# EAGLE schematic openSX70-dongle_SEEED_v400 (EAGLE 9.0.0)
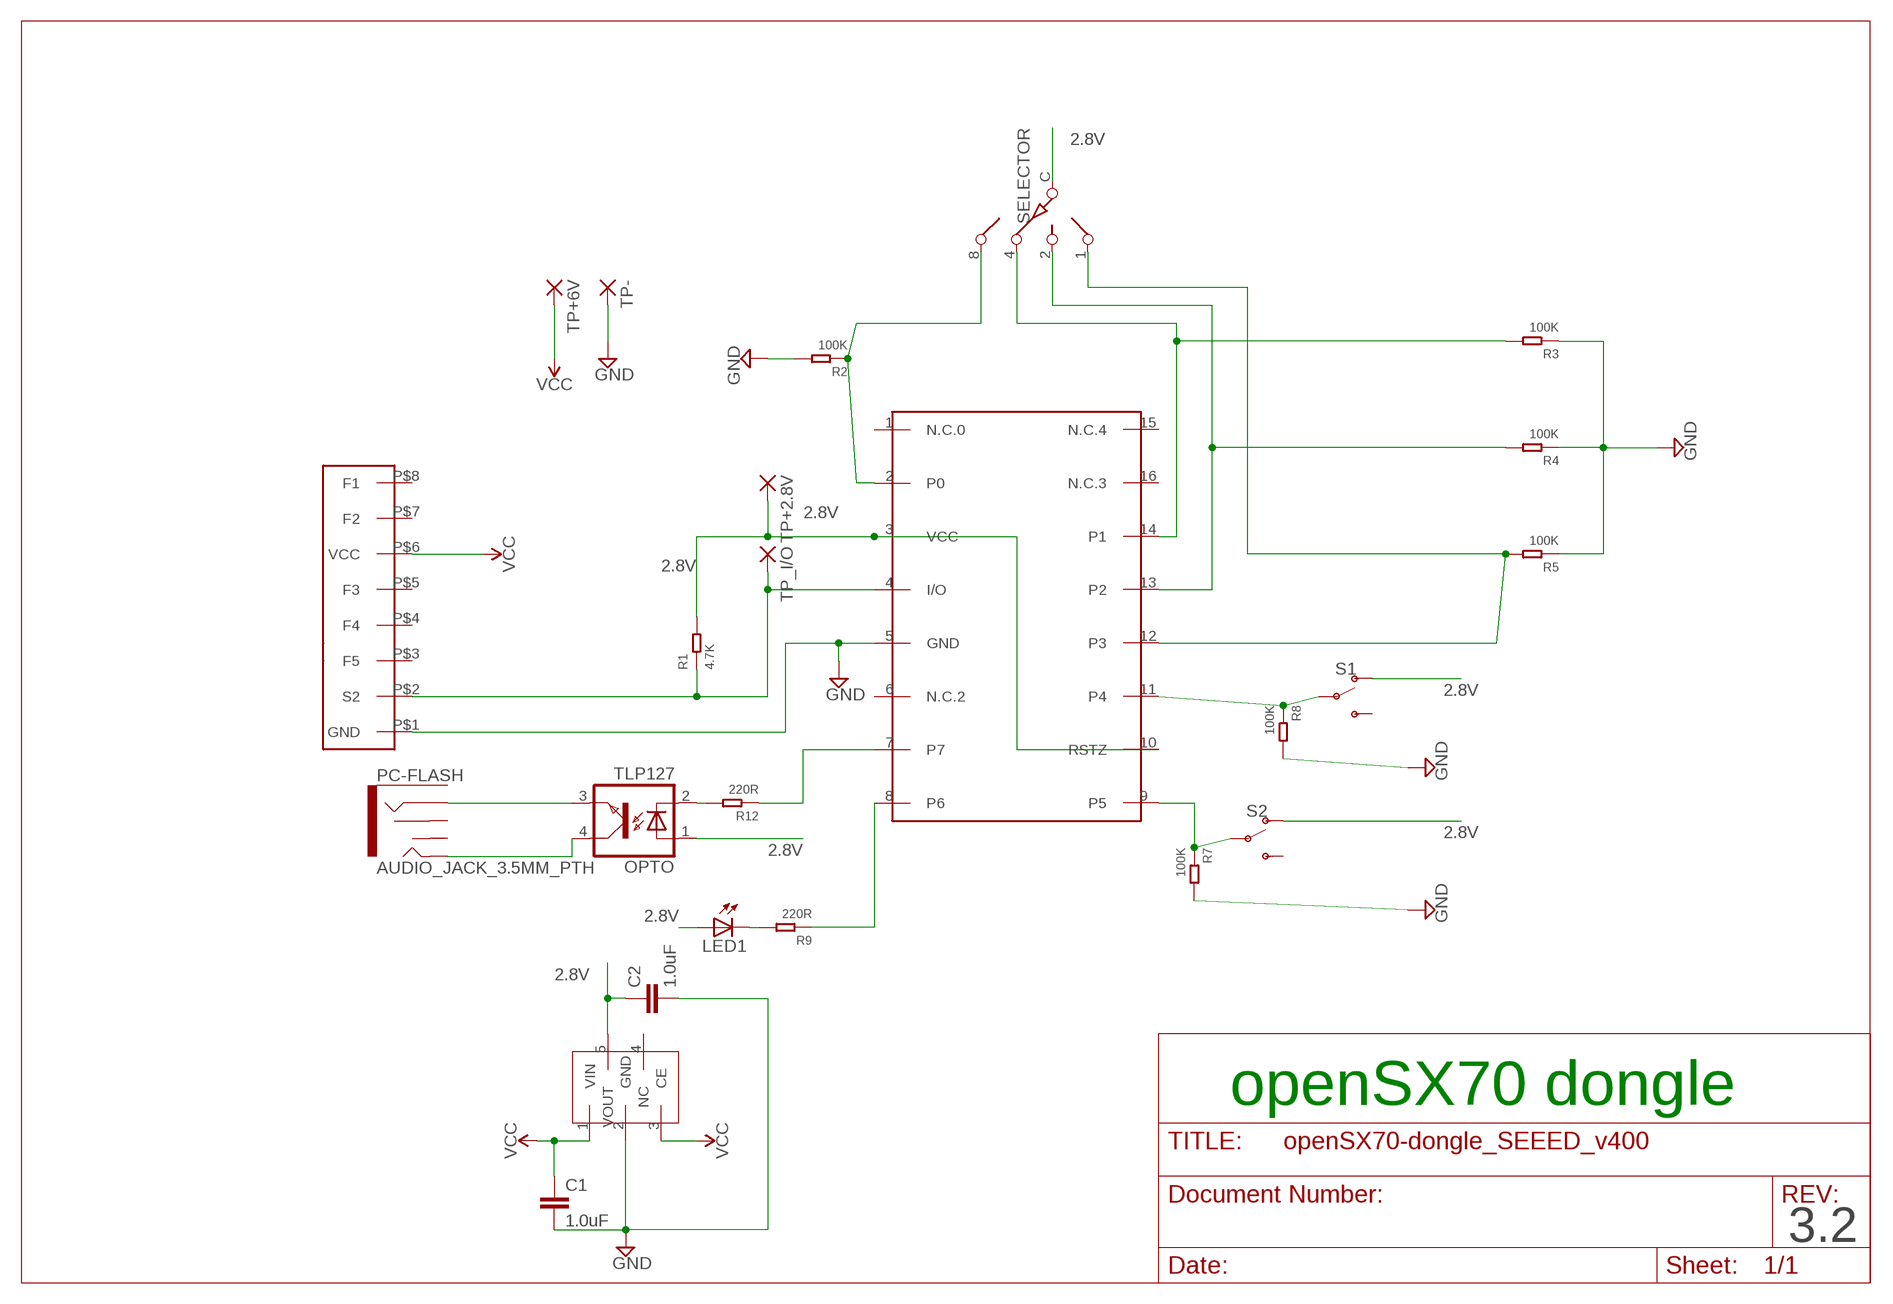
[diagram p0: schematic, sheet 1]

## Parts
C1  1.0uF  C-EUC0603  [C0603]
C2  1.0uF  C-EUC0603  [C0603]
DS2408  DS2408  [SO16]
LED1  LED3MM  [LED3MM]
OPTO  TLP127  [SO-4]
PC-FLASH  AUDIO_JACK_3.5MM_PTH  [AUDIO-JACK]
R1  4.7K  SMD-RES-4.7K-5%-1/10W(0603)  [R0603]
R2  100K  SMD-RES-100K-1%-1/10W(0603)  [R0603]
R3  100K  SMD-RES-100K-1%-1/10W(0603)  [R0603]
R4  100K  SMD-RES-100K-1%-1/10W(0603)  [R0603]
R5  100K  SMD-RES-100K-1%-1/10W(0603)  [R0603]
R7  100K  SMD-RES-100K-1%-1/10W(0603)  [R0603]
R8  100K  SMD-RES-100K-1%-1/10W(0603)  [R0603]
R9  220R  SMD-RES-220R-5%-1/10W(0603)  [R0603]
R12  220R  SMD-RES-220R-5%-1/10W(0603)  [R0603]
REG  NCP4688  [SOT-23-5]
S1  SWITCH-SPDT-SMD-RIGHT-ANGLE  [SWITCH_SPST_SMD_A]
S2  SWITCH-SPDT-SMD-RIGHT-ANGLE  [SWITCH_SPST_SMD_A]
SELECTOR  SW-C16  [SW-C16]
TP+2.8V  SMD2  [SMD1,27-2,54]
TP+6V  SMD2  [SMD1,27-2,54]
TP-  SMD2  [SMD1,27-2,54]
TP_I/O  SMD2  [SMD1,27-2,54]
U$1  FLASH-EDGE-CONNECTOR  [FLASH-EDGE-8]

## Nets
2.8V: C2.1 DS2408.3(VCC) DS2408.10(RSTZ) LED1.A OPTO.1(A) R1.2 REG.5(VOUT) S1.1(O) S2.1(O) SELECTOR.C TP+2.8V.1(P)
GND: C1.2 C2.2 DS2408.5(GND) R2.2 R3.1 R4.1 R5.1 R7.2 R8.2 REG.2(GND) TP-.1(P) U$1.P$1(GND)
N$1: DS2408.4(I/O) R1.1 TP_I/O.1(P) U$1.P$2(S2)
N$2: LED1.K(C) R9.2
N$3: DS2408.2(P0) R2.1 SELECTOR.8
N$4: DS2408.14(P1) R3.2 SELECTOR.4
N$5: DS2408.13(P2) R4.2 SELECTOR.2
N$6: DS2408.11(P4) R8.1 S1.2(P)
N$7: DS2408.9(P5) R7.1 S2.2(P)
N$8: DS2408.8(P6) R9.1
N$10: OPTO.2(C) R12.2
N$11: DS2408.7 R12.1
N$12: OPTO.4(COL) PC-FLASH.TIP
N$13: DS2408.12(P3) R5.2 SELECTOR.1
N$15: OPTO.3(EMIT) PC-FLASH.RING
VCC: C1.1 REG.1(VIN) REG.3(CE) TP+6V.1(P) U$1.P$6(VCC)
Unconnected: DS2408.1(N.C.0) DS2408.6(N.C.2) DS2408.15(N.C.4) DS2408.16(N.C.3) PC-FLASH.RSH PC-FLASH.SLEEVE PC-FLASH.TSH REG.4(NC) S1.3(S) S2.3(S) U$1.P$3(F5) U$1.P$4(F4) U$1.P$5(F3) U$1.P$7(F2) U$1.P$8(F1)

## Notes on the sheet
- openSX70 dongle
- 3.2

## Library data of the parts
C1 C2 = rcl:C-EU: CAPACITOR, European symbol; SPICEPREFIX: C
DS2408 = DS2408-joaco:DS2408
LED1 = adafruit:LED: LED OSRAM: - CHIPLED LG R971, LG N971, LY N971, LG Q971, LY Q971, LO R971, LY R971 LH N974, LH R974 LS Q976, LO Q976, LY Q976 LO Q996 - Hyper CHIPLED LW Q18S LB Q993, LB Q99A, LB R99A - SideLED LS A670, LO A670, LY A670, LG A670, LP A670 LB A673, LV A673, LT A673, LW A673 LH A674 LY A675 LS A676, LA A676, LO A676, LY A676, LW A676 LS A679, LY A679, LG A679 - Hyper Micro SIDELED® LS Y876, LA Y876, LO Y876, LY Y876 LT Y87S - SmartLED LW L88C, LW L88S LB L89C, LB L89S, LG L890 LS L89K, LO L89K, LY L89K LS L896, LA L896, LO L896, LY L896 - TOPLED LS T670, LO T670, LY T670, LG T670, LP T670 LSG T670, LSP T670, LSY T670, LOP T670, LYG T670 LG T671, LOG T671, LSG T671 LB T673, LV T673, LT T673, LW T673 LH T674 LS T676, LA T676, LO T676, LY T676, LB T676, LH T676, LSB T676, LW T676 LB T67C, LV T67C, LT T67C, LS T67K, LO T67K, LY T67K, LW E67C LS E67B, LA E67B, LO E67B, LY E67B, LB E67C, LV E67C, LT E67C LW T67C LS T679, LY T679, LG T679 LS T770, LO T770, LY T770, LG T770, LP T770 LB T773, LV T773, LT T773, LW T773 LH T774 LS E675, LA E675, LY E675, LS T675 LS T776, LA T776, LO T776, LY T776, LB T776 LHGB T686 LT T68C, LB T68C - Hyper Mini TOPLED® LB M676 - Mini TOPLED Santana® LG M470 LS M47K, LO M47K, LY M47K Source: http://www.osram.convergy.de/
OPTO = openSX70:TLP127
PC-FLASH = SparkFun-Connectors:AUDIO_JACK_3.5MM: Audio Jack 3.5mm variants of PTH and SMT stereo audio jack with bypass switches. SparkFun Products: SparkFun SparkPunk Sound Kit <[https://www.sparkfun.com/products/11177]> - PTH MP3 Trigger <https://www.sparkfun.com/products/13720> -3.5mm SMD SparkFun PicoBoard <https://www.sparkfun.com/products/11888>- 2.5mm SMD; PROD_ID: CONN-08774; SF_ID: PRT-08032
R1 = Seeed-Resistor:SMD-RES-4.7K-5%-1/10W(0603): 301010290; MPN: RC0603JR-074K7L
R2-R5 R7 R8 = Seeed-Resistor:SMD-RES-100K-1%-1/10W(0603): 301010196; MPN: RC0603FR-07100KL
R9 R12 = Seeed-Resistor:SMD-RES-220R-5%-1/10W(0603): 301010163; MPN: RC0603JR-07220RL
REG = openSX70:NCP4688
S1 S2 = SparkFun-Switches:SWITCH-SPDT: Single Pole, Double Throw (SPDT) Switch Single-pole, double-throw (SPDT) switch. Variant Overview SMD-AYZ0202 Surface Mount DPDT Switch <https://www.sparkfun.com/products/597> (COM-00597) Used on e.g. LilyPad Arduino USB - ATmega32U4 Board <https://www.sparkfun.com/products/12049> PTH-11.6X4.0MM SPDT Mini Power Switch <https://www.sparkfun.com/products/102> (COM-00102) Used on e.g. SparkFun Simon Says - Through-Hole Soldering Kit <https://www.sparkfun.com/products/10547> (KIT-10547) PTH-11.6X4.0MM-KIT KIT version of SPDT Mini Power Switch - Simplifies soldering by removing tStop of switch pins - only one side can be soldered. PTH-11.6X4.0MM-LOCK LOCK version of SPDT Mini Power Switch - Offset pins hold switch in place for easier soldering. SMD-RIGHT-ANGLE Surface Mount Right Angle Switch <https://www.sparkfun.com/products/10860> (COM-10860) Used on e.g. SparkFun ESP8266 Thing <https://www.sparkfun.com/products/13231>; PROD_ID: SWCH-10651; SF_SKU: COM-10860
SELECTOR = special:SW-C16: SWITCH 16-step rotary switch
TP+2.8V TP+6V TP- TP_I/O = wirepad:SMD2: SMD PAD
U$1 = SX70-flash:FLASH-EDGE-CONNECTOR

## Net classes
0 GND: width 0.305 mm
1 VCC: width 0.254 mm
2 2.8V: width 0.254 mm